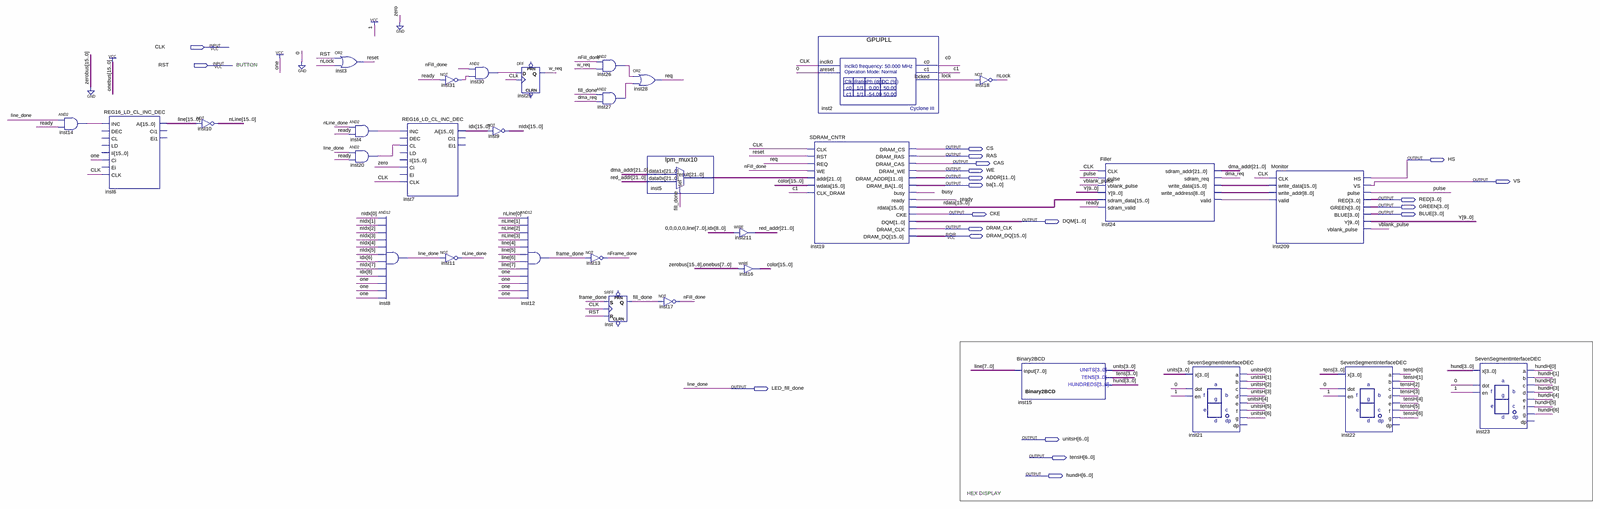
[diagram p0: schematic sheet, whole]
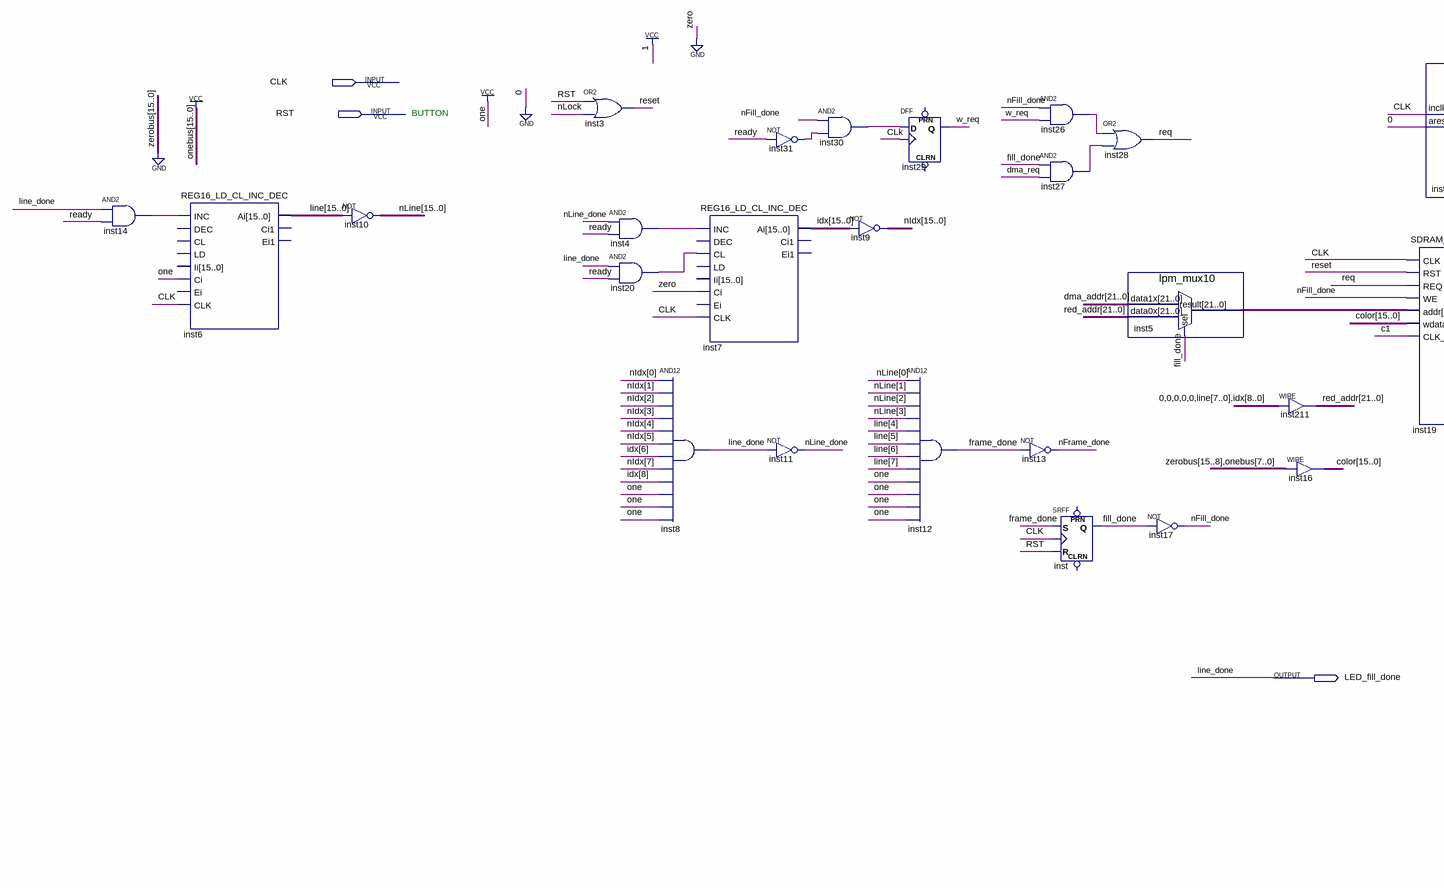
[diagram p1: schematic sheet, left part]
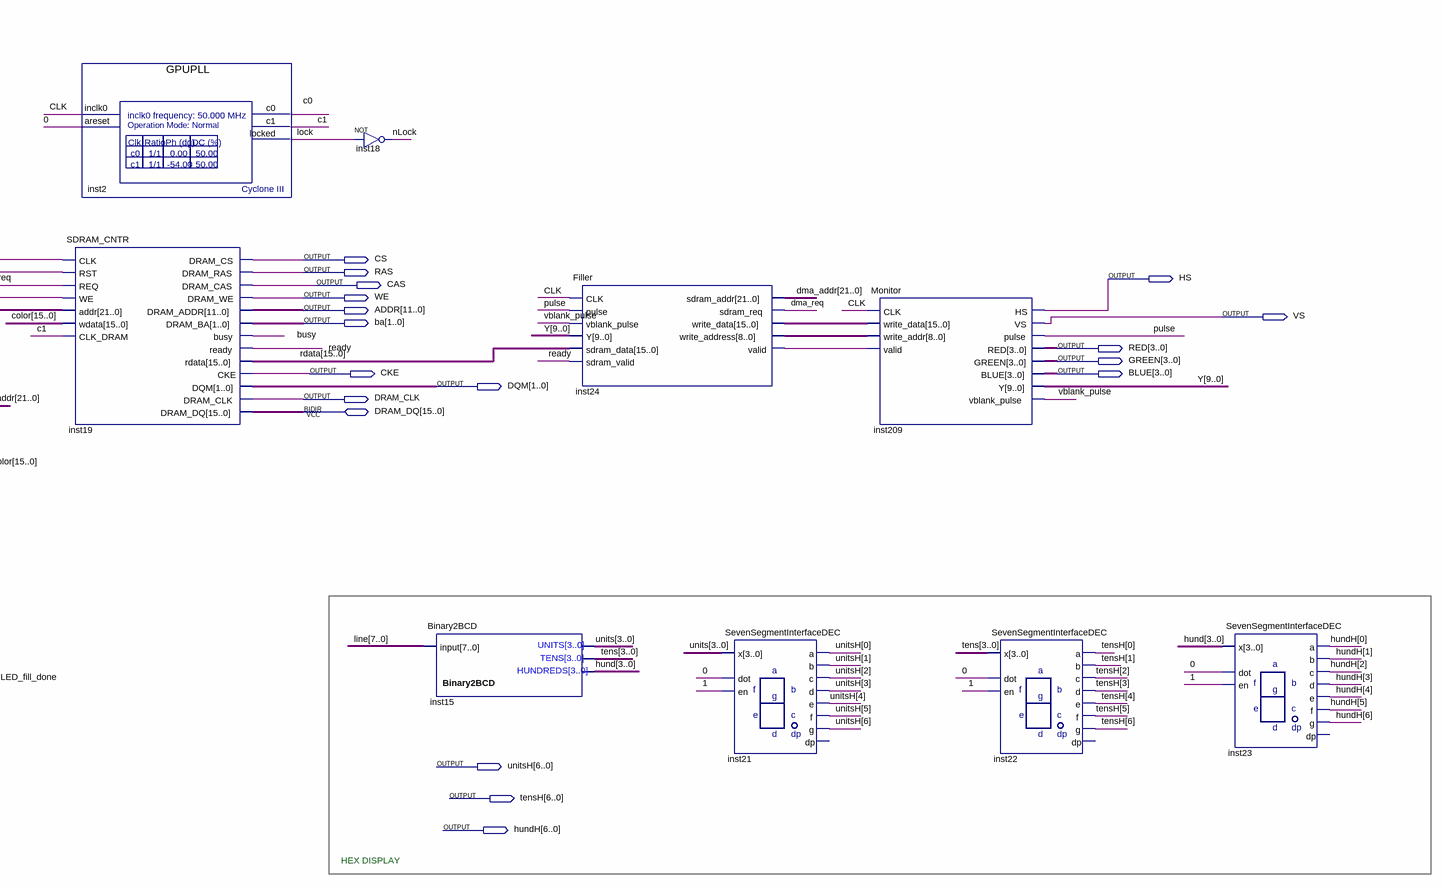
[diagram p2: schematic sheet, right part]
// Quartus schematic testSdramVgaDma.bdf as structural Verilog: 32 symbols, 21 pins
module testSdramVgaDma (
  input  CLK,
  input  RST,
  inout  [15:0] DRAM_DQ,
  output CS,
  output RAS,
  output HS,
  output CAS,
  output WE,
  output [11:0] ADDR,
  output VS,
  output [1:0] ba,
  output [3:0] RED,
  output [3:0] GREEN,
  output CKE,
  output [3:0] BLUE,
  output [1:0] DQM,
  output DRAM_CLK,
  output LED_fill_done,
  output [6:0] unitsH,
  output [6:0] tensH,
  output [6:0] hundH
);

  wire busy, c0, c1, dma_req, fill_done, frame_done, inst4_out, inst14_out, inst20_out, inst24_valid,
       inst26_out, inst27_out, inst30_out, inst31_out, lock, nFill_done, nFrame_done, nLine_done, nLock,
       pulse, ready, req, reset, vblank_pulse, w_req;
  wire [3:0] hund, tens, units;
  wire [8:0] inst24_write_address;
  wire [9:0] Y;
  wire [15:0] color, idx, inst24_write_data, line, nIdx, nLine, rdata;
  wire [21:0] dma_addr, inst5_result, red_addr;

  and inst14 (inst14_out, LED_fill_done, ready);
  REG16_LD_CL_INC_DEC inst6 (.INC(inst14_out), .Ci(1'b1), .CLK(CLK), .Ai(line));  // open: DEC, CL, LD, Ii, Ei, Ci1, Ei1
  assign nLine = ~line;  // NOT inst10, 16 bits wide
  or inst3 (reset, RST, nLock);
  and inst4 (inst4_out, nLine_done, ready);
  and inst20 (inst20_out, LED_fill_done, ready);
  and inst8 (LED_fill_done, nIdx[0], nIdx[1], nIdx[2], nIdx[3], nIdx[4], nIdx[5], idx[6], nIdx[7], idx[8], 1'b1, 1'b1, 1'b1);
  REG16_LD_CL_INC_DEC inst7 (
    .INC(inst4_out), .CL(inst20_out), .Ci(1'b0), .CLK(CLK), .Ai(idx));  // open: DEC, LD, Ii, Ei, Ci1, Ei1
  not inst31 (inst31_out, ready);
  not inst11 (nLine_done, LED_fill_done);
  and inst30 (inst30_out, nFill_done, inst31_out);
  assign nIdx = ~idx;  // NOT inst9, 16 bits wide
  DFF inst29 (.CLK(CLK), .D(inst30_out), .Q(w_req));  // open: CLRN, PRN
  and inst12 (frame_done, nLine[0], nLine[1], nLine[2], nLine[3], line[4], line[5], line[6], line[7], 1'b1, 1'b1, 1'b1, 1'b1);
  and inst26 (inst26_out, nFill_done, w_req);
  and inst27 (inst27_out, fill_done, dma_req);
  not inst13 (nFrame_done, frame_done);
  SRFF inst (.S(frame_done), .R(RST), .CLK(CLK), .Q(fill_done));  // open: PRN, CLRN
  or inst28 (req, inst26_out, inst27_out);
  lpm_mux10 inst5 (.data1x(dma_addr), .data0x(red_addr), .sel(fill_done), .result(inst5_result));
  not inst17 (nFill_done, fill_done);
  assign red_addr = {{5{1'b0}}, line[7:0], idx[8:0]};  // WIRE inst211
  assign color = 16'b0000000011111111;  // WIRE inst16
  SDRAM_CNTR inst19 (
    .CLK(CLK), .RST(reset), .REQ(req), .WE(nFill_done), .addr(inst5_result), .wdata(color), .CLK_DRAM(c1),
    .DRAM_CS(CS), .DRAM_RAS(RAS), .DRAM_CAS(CAS), .DRAM_WE(WE), .DRAM_ADDR(ADDR), .DRAM_BA(ba), .busy(busy),
    .ready(ready), .rdata(rdata), .CKE(CKE), .DQM(DQM), .DRAM_CLK(DRAM_CLK), .DRAM_DQ(DRAM_DQ));
  GPUPLL inst2 (.inclk0(CLK), .areset(1'b0), .c0(c0), .c1(c1), .locked(lock));
  not inst18 (nLock, lock);
  Binary2BCD inst15 (.\input (line[7:0]), .bcd_hundreds(hund), .bcd_tens(tens), .bcd_units(units));
  Filler inst24 (
    .CLK(CLK), .pulse(pulse), .vblank_pulse(vblank_pulse), .Y(Y), .sdram_data(rdata), .sdram_valid(ready),
    .sdram_addr(dma_addr), .sdram_req(dma_req), .write_data(inst24_write_data),
    .write_address(inst24_write_address), .valid(inst24_valid));
  SevenSegmentInterfaceDEC inst21 (
    .dot(1'b0), .en(1'b1), .x(units), .a(unitsH[0]), .b(unitsH[1]), .c(unitsH[2]), .d(unitsH[3]),
    .e(unitsH[4]), .f(unitsH[5]), .g(unitsH[6]));  // open: dp
  Monitor inst209 (
    .CLK(CLK), .write_data(inst24_write_data), .write_addr(inst24_write_address), .valid(inst24_valid),
    .HS(HS), .VS(VS), .pulse(pulse), .RED(RED), .GREEN(GREEN), .BLUE(BLUE), .Y(Y), .vblank_pulse(vblank_pulse));
  SevenSegmentInterfaceDEC inst22 (
    .dot(1'b0), .en(1'b1), .x(tens), .a(tensH[0]), .b(tensH[1]), .c(tensH[2]), .d(tensH[3]), .e(tensH[4]),
    .f(tensH[5]), .g(tensH[6]));  // open: dp
  SevenSegmentInterfaceDEC inst23 (
    .dot(1'b0), .en(1'b1), .x(hund), .a(hundH[0]), .b(hundH[1]), .c(hundH[2]), .d(hundH[3]), .e(hundH[4]),
    .f(hundH[5]), .g(hundH[6]));  // open: dp

  // Other names for the same wires on the sheet: line_done = LED_fill_done

  // Notes on the sheet:
  //   BUTTON
  //   HEX DISPLAY
endmodule
